# EAGLE design project2 (EAGLE 9.6.2)
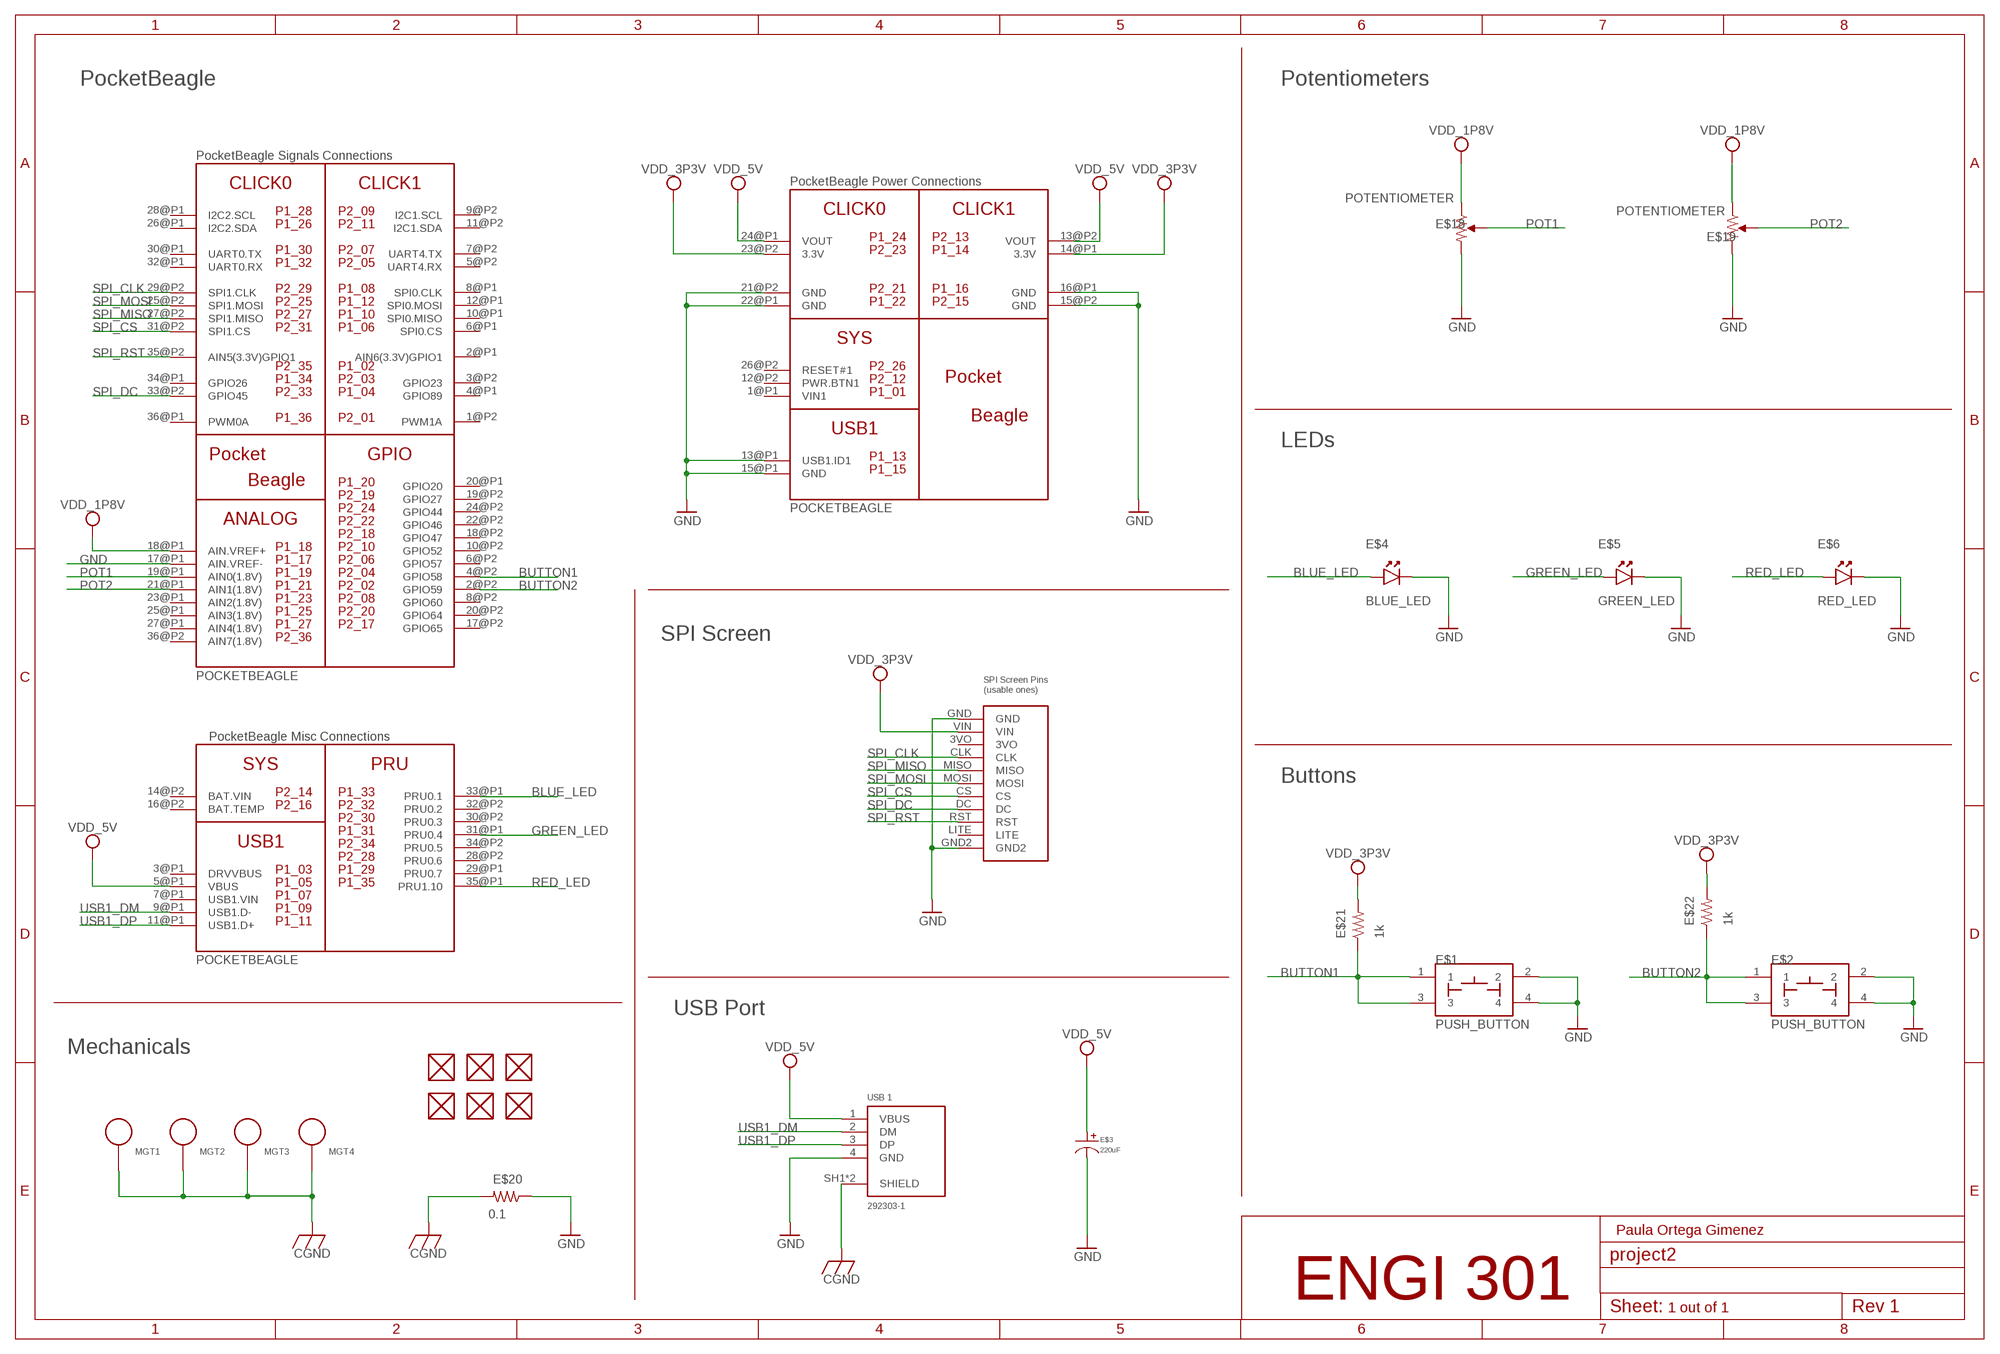
[diagram p0: schematic, sheet 1]

## Parts
E$1  PUSH_BUTTON  [BUTTON_12.5MM]
E$2  PUSH_BUTTON  [BUTTON_12.5MM]
E$3  220uF  CAPACITOR_P_10MM  [CP10MM]
E$4  BLUE_LED  LED  [EIA-STD]
E$5  GREEN_LED  LED  [EIA-STD]
E$6  RED_LED  LED  [EIA-STD]
E$18  POTENTIOMETER  [POT-PO90S]
E$19  POTENTIOMETER  [POT-PO90S]
E$20  0.1  R_R0805  [R0805]
E$21  1k  R_R0805  [R0805]
E$22  1k  R_R0805  [R0805]
E$24  292303-1  [TE_292303-1]
FUD1  FIDUCIAL  [FIDUCIAL_40MIL]
FUD2  FIDUCIAL  [FIDUCIAL_40MIL]
FUD3  FIDUCIAL  [FIDUCIAL_40MIL]
FUD4  FIDUCIAL  [FIDUCIAL_40MIL]
FUD5  FIDUCIAL  [FIDUCIAL_40MIL]
FUD6  FIDUCIAL  [FIDUCIAL_40MIL]
MGT1  MOUNTING_HOLE  [MOUNTING_HOLE]
MGT2  MOUNTING_HOLE  [MOUNTING_HOLE]
MGT3  MOUNTING_HOLE  [MOUNTING_HOLE]
MGT4  MOUNTING_HOLE  [MOUNTING_HOLE]
U1  SPI  [SPI]
U$1  POCKETBEAGLE  [POCKETBEAGLE]

## Nets
BLUE_LED: E$4.ANODE U$1.33@P1(PRU0.1)
BUTTON1: E$1.1 E$1.3 E$21.1 U$1.4@P2(GPIO58)
BUTTON2: E$2.1 E$2.3 E$22.1 U$1.2@P2(GPIO59)
CGND: E$20.2 E$24.SH1(SHIELD) E$24.SH2(SHIELD) MGT1.P$1 MGT2.P$1 MGT3.P$1 MGT4.P$1
GND: E$1.2 E$1.4 E$2.2 E$2.4 E$3.P$2 E$4.CATHODE E$5.CATHODE E$6.CATHODE E$18.CW E$19.CW E$20.1 E$24.4(GND) U1.GND U1.GND2 U$1.13@P1(USB1.ID1) U$1.15@P1(GND) U$1.15@P2(GND) U$1.16@P1(GND) U$1.17@P1(AIN.VREF-) U$1.21@P2(GND) U$1.22@P1(GND)
GREEN_LED: E$5.ANODE U$1.31@P1(PRU0.4)
POT1: E$18.S U$1.19@P1(AIN0(1.8V))
POT2: E$19.S U$1.21@P1(AIN1(1.8V))
RED_LED: E$6.ANODE U$1.35@P1(PRU1.10)
SPI_CLK: U1.CLK U$1.29@P2(SPI1.CLK)
SPI_CS: U1.CS U$1.31@P2(SPI1.CS)
SPI_DC: U1.DC U$1.33@P2(GPIO45)
SPI_MISO: U1.MISO U$1.27@P2(SPI1.MISO)
SPI_MOSI: U1.MOSI U$1.25@P2(SPI1.MOSI)
SPI_RST: U1.RST U$1.35@P2(AIN5(3.3V)GPIO1)
USB1_DM: E$24.2(DM) U$1.9@P1(USB1.D-)
USB1_DP: E$24.3(DP) U$1.11@P1(USB1.D+)
VDD_1P8V: E$18.CCW E$19.CCW U$1.18@P1(AIN.VREF+)
VDD_3P3V: E$21.2 E$22.2 U1.VIN U$1.14@P1(3.3V) U$1.23@P2(3.3V)
VDD_5V: E$3.P$1 E$24.1(VBUS) U$1.5@P1(VBUS) U$1.13@P2(VOUT) U$1.24@P1(VOUT)
Unconnected: FUD1.P$1 FUD2.P$1 FUD3.P$1 FUD4.P$1 FUD5.P$1 FUD6.P$1 U1.3VO U1.LITE U$1.1@P2(PWM1A) U$1.2@P1(AIN6(3.3V)GPIO1) U$1.3@P1(DRVVBUS) U$1.3@P2(GPIO23) U$1.4@P1(GPIO89) U$1.5@P2(UART4.RX) U$1.6@P1(SPI0.CS) U$1.6@P2(GPIO57) U$1.7@P1(USB1.VIN) U$1.7@P2(UART4.TX) U$1.8@P1(SPI0.CLK) U$1.8@P2(GPIO60) U$1.9@P2(I2C1.SCL) U$1.10@P1(SPI0.MISO) U$1.10@P2(GPIO52) U$1.11@P2(I2C1.SDA) U$1.12@P1(SPI0.MOSI) U$1.12@P2(PWR.BTN1) U$1.16@P2(BAT.TEMP) U$1.17@P2(GPIO65) U$1.18@P2(GPIO47) U$1.19@P2(GPIO27) U$1.20@P1(GPIO20) U$1.20@P2(GPIO64) U$1.22@P2(GPIO46) U$1.23@P1(AIN2(1.8V)) U$1.24@P2(GPIO44) U$1.25@P1(AIN3(1.8V)) U$1.26@P1(I2C2.SDA) U$1.26@P2(RESET#1) U$1.27@P1(AIN4(1.8V)) U$1.28@P1(I2C2.SCL) U$1.28@P2(PRU0.6) U$1.29@P1(PRU0.7) U$1.30@P1(UART0.TX) U$1.30@P2(PRU0.3) U$1.32@P1(UART0.RX) U$1.32@P2(PRU0.2) U$1.34@P1(GPIO26) U$1.34@P2(PRU0.5) U$1.36@P1(PWM0A) U$1.36@P2(AIN7(1.8V))

## Notes on the sheet
- PocketBeagle | Potentiometers
- LEDs
- SPI Screen
- Buttons
- USB Port
- Mechanicals
- Paula Ortega Gimenez
- ENGI 301
- 1 out of 1

## Power pins joined to a net without a drawn wire
BAT.VIN: U$1.14@P2(BAT.VIN)
VIN1: U$1.1@P1(VIN1)

## Library data of the parts
E$1 E$2 = project2:PUSH_BUTTON
E$3 = project2:CAPACITOR_P: Library: MF_Passives Description: Device for Polarized Capacitors. Manufacture part number (MPN), Voltage Rating, and Tolerance can be added via Attributes. Check https://factory.macrofab.com/parts for the house parts list.; POPULATE: 1
E$4-E$6 = project2:LED: LTST-C191TBKT
E$18 E$19 = project2:POTENTIOMETER: Potentiometer - Examples: P090S-14T20BR10K (987-1277-ND)
E$20-E$22 = project2:R_: RESISTOR, American symbol
E$24 = project2:292303-1: CONN USB RECEPT R/A TYPE A 4POS; CENTERLINE_PITCH: 2 mm[.078 in]; CHECK_PRICES: https://www.snapeda.com/parts/292303-1/TE+Connectivity+AMP+Connectors/view-part/?ref=eda; COMMENT: 292303-1; DESCRIPTION: Type A Standard USB Connector 4 Position Right Angle Mount 1 Port | TE Connectivity 292303-1; DIGIKEY_PART_NUMBER: A31726-ND; EU_ROHS_COMPLIANCE: Compliant; MF: TE Connectivity; MP: 292303-1; NUMBER_OF_POSITIONS: 4; PACKAGE: None; PRODUCT_TYPE: Connector; PURCHASE-URL: https://www.snapeda.com/api/url_track_click_mouser/?unipart_id=447501&manufacturer=TE Connectivity&part_name=292303-1&search_term=292303-1; SNAPEDA_LINK: https://www.snapeda.com/parts/292303-1/TE+Connectivity+AMP+Connectors/view-part/?ref=snap
FUD1-FUD6 = project2:FIDUCIAL
MGT1-MGT4 = project2:MOUNTING_HOLE: Chassis Mounting Hole w/GND connection ability
U1 = project2:SPI
U$1 = project2:POCKETBEAGLE

## Board
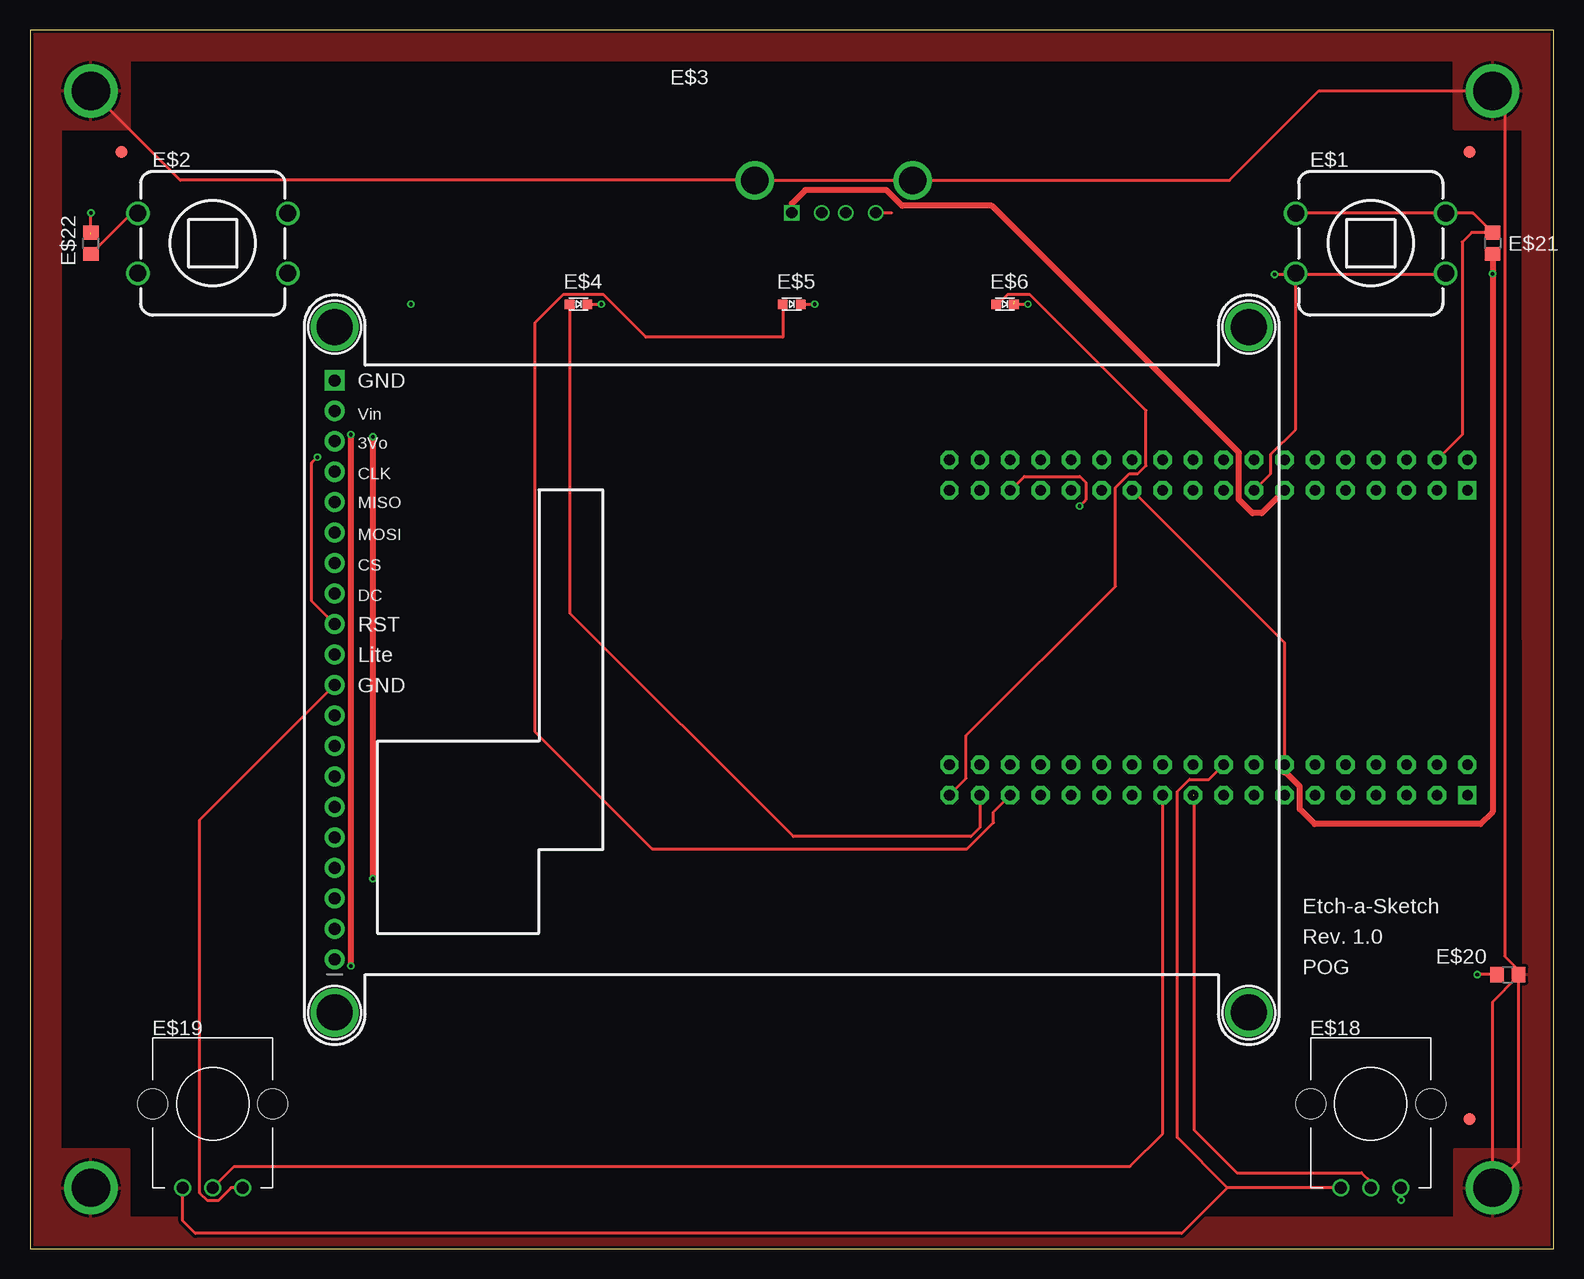
[diagram p1: board, top side]
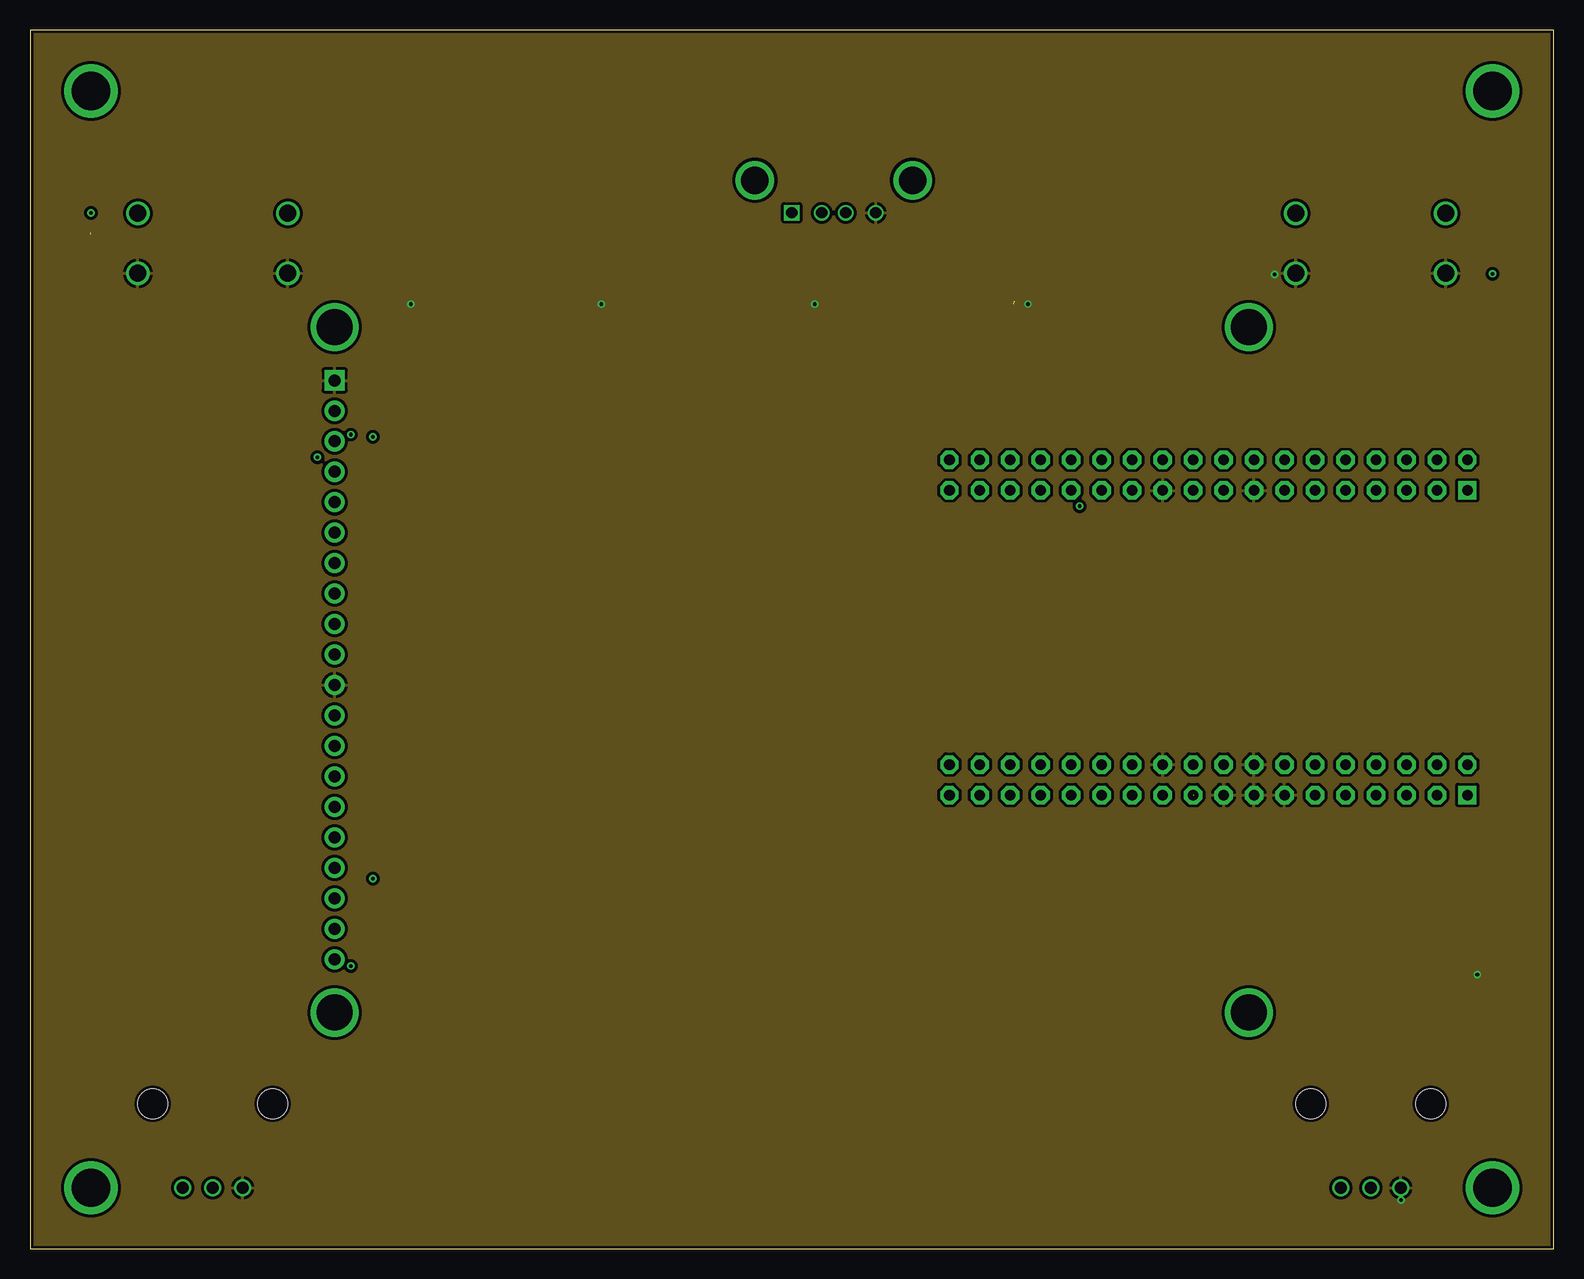
[diagram p2: board, inner layer Route2]
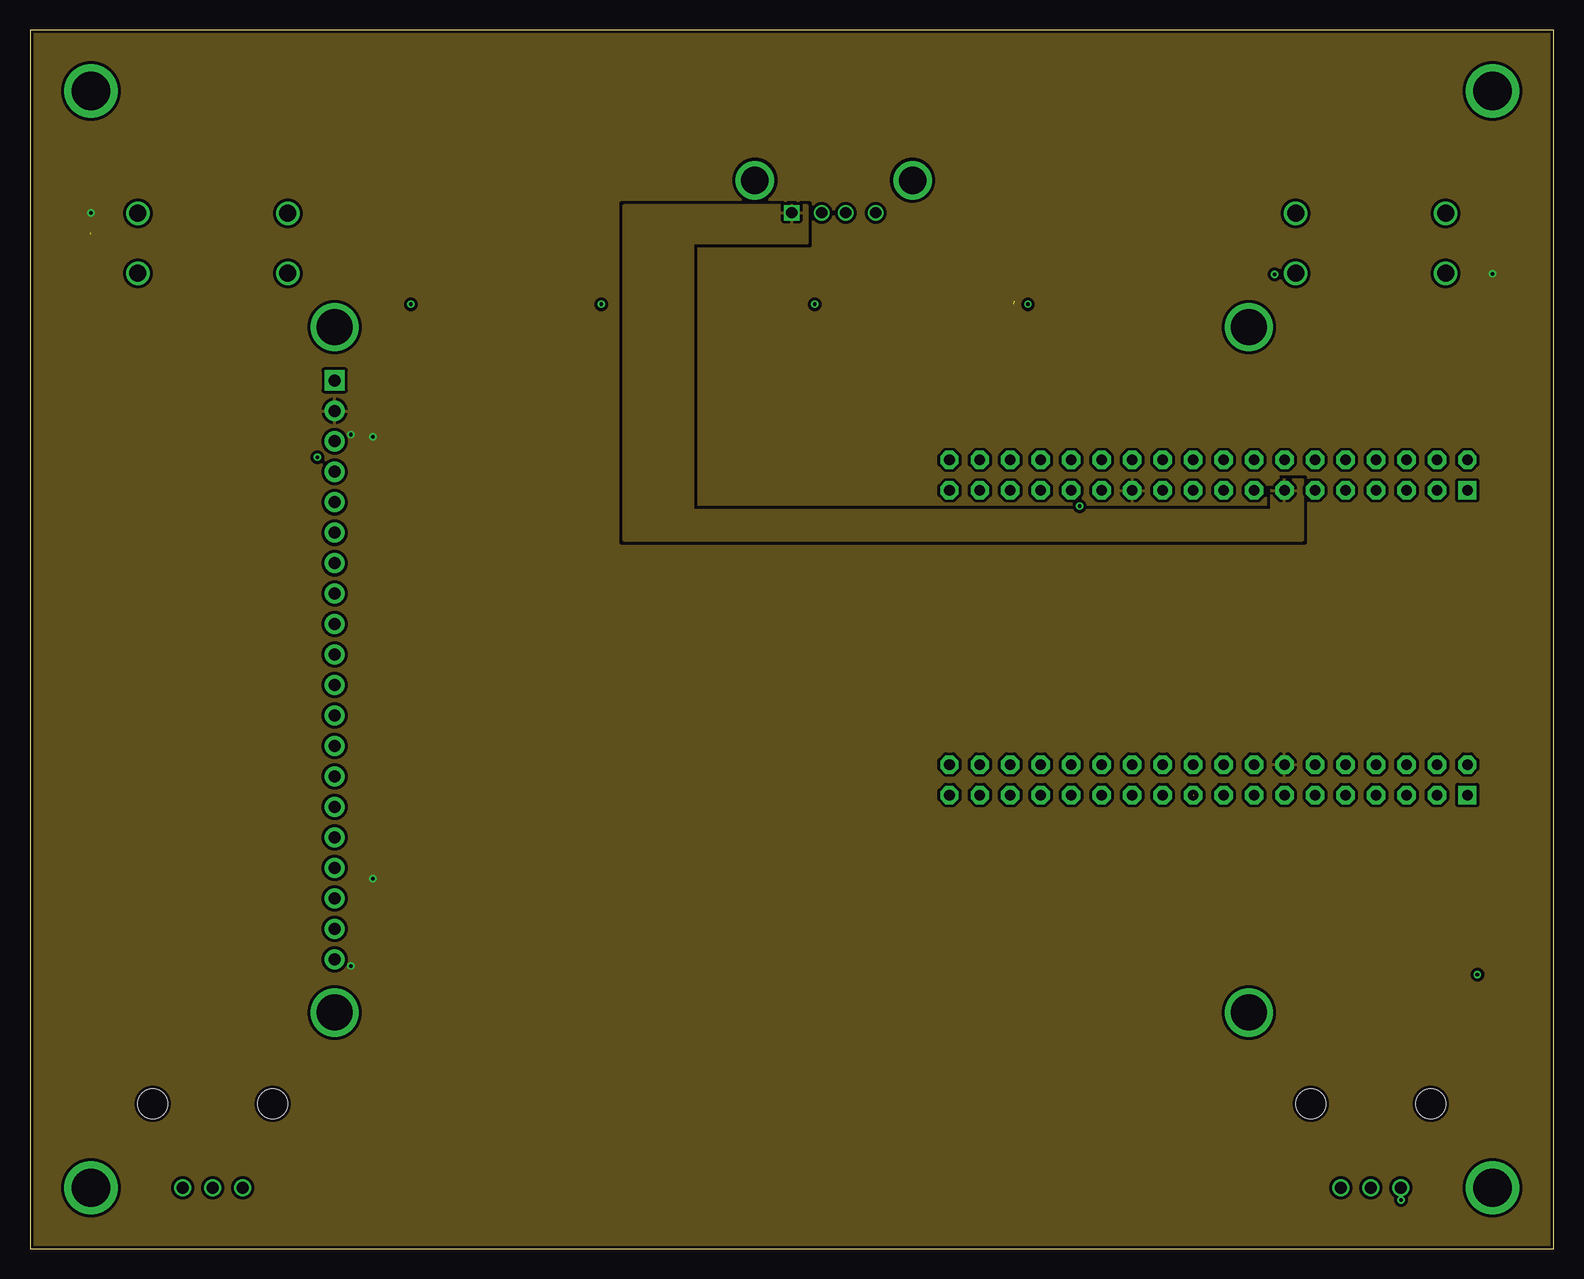
[diagram p3: board, inner layer Route15]
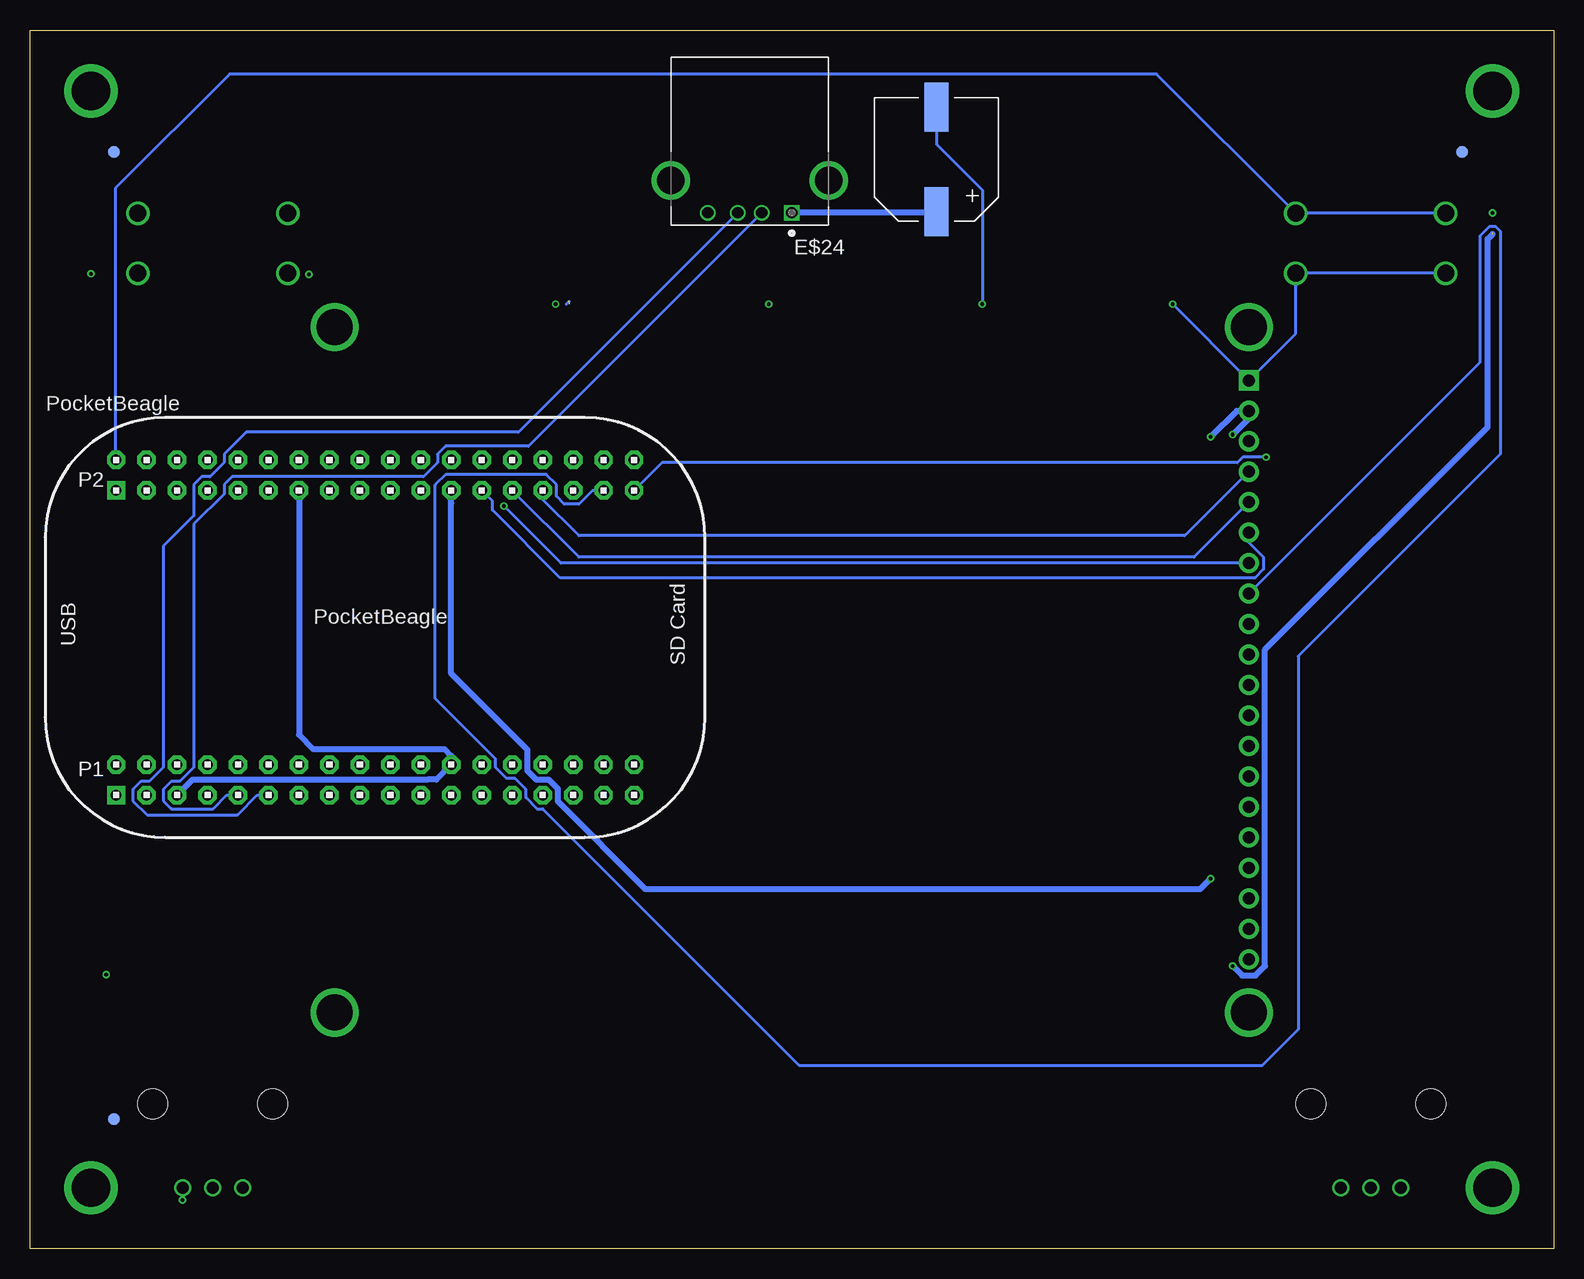
[diagram p4: board, bottom side, seen from below]

Size 127 x 101.6 mm. Coordinates in mm from the lower left corner, seen from the top.
Outline: 0,0 127,0 127,101.6 0,101.6 0,0
Copper layers (1*2*15*16): Top 0.035mm / dielectric 0.23mm / Route2 0.035mm / dielectric 0.93mm / Route15 0.035mm / dielectric 0.23mm / Bottom 0.035mm
Design rules "ENGI301_4lyr": minimum track width 10mil, minimum drill 12mil, track to track 10mil, track to pad 10mil, pad to pad 10mil, via to via 10mil, smd to smd 10mil, copper to edge 10mil, drill to drill 12mil, minimum pad ring 6mil, minimum via ring 6mil, stop-mask expansion 3mil, vias tented up to drill 25mil, thermal gap 10mil

### Footprints (pad centres in the part's own frame; a part is rotated, then mirrored left to right if it is on the bottom)
BUTTON_12.5MM = drill 1.4: 1 -6.25,2.5; 2 -6.25,-2.5; 3 6.25,2.5; 4 6.25,-2.5
CP10MM = smd 2 x 4.1: P$1 0,-4.35; P$2 0,4.35
EIA-STD = smd 0.8 x 0.8: ANODE -0.74,0; CATHODE 0.74,0
POT-PO90S = drill 1: CCW -2.5,0; CW 2.5,0; S 0,0 | hole 2.5: -5,7; 5,7
R0805 = smd 1.143 x 1.27: 1 -0.889,0; 2 0.889,0
TE_292303-1 = drill 0.92 square: 1 0,0 | drill 0.92: 2 2.5,0; 3 4.5,0; 4 7,0 | drill 2.3: SH1 -3.07,-2.71; SH2 10.07,-2.71
FIDUCIAL_40MIL = smd 1.016 x 1.016: P$1 0,0
MOUNTING_HOLE = drill 3.175 pad 4.445: P$1 0,0
SPI = drill 1 pad 1.676: 3VO -19.05,-38.1; 12@JP2 3.81,-38.1; 13@JP2 6.35,-38.1; 14@JP2 8.89,-38.1; 15@JP2 11.43,-38.1; 16@JP2 13.97,-38.1; 17@JP2 16.51,-38.1; 18@JP2 19.05,-38.1; 19@JP2 21.59,-38.1; 20@JP2 24.13,-38.1; CLK -16.51,-38.1; CS -8.89,-38.1; DC -6.35,-38.1; GND2 1.27,-38.1; LITE -1.27,-38.1; MISO -13.97,-38.1; MOSI -11.43,-38.1; RST -3.81,-38.1; VIN -21.59,-38.1 | drill 1 pad 1.676 square: GND -24.13,-38.1 | drill 3 pad 3.6: P$1@U$7 -28.575,-38.1; P$1@U$15 28.575,-38.1; P$1@U$16 -28.575,38.1; P$1@U$17 28.575,38.1
POCKETBEAGLE = drill 0.889 pad 1.524 square: 1@P1 5.91,3.53; 1@P2 5.91,28.93 | drill 0.889 pad 1.524 octagon: 2@P1 5.91,6.07; 2@P2 5.91,31.47; 3@P1 8.45,3.53; 3@P2 8.45,28.93; 4@P1 8.45,6.07; 4@P2 8.45,31.47; 5@P1 10.99,3.53; 5@P2 10.99,28.93; 6@P1 10.99,6.07; 6@P2 10.99,31.47; 7@P1 13.53,3.53; 7@P2 13.53,28.93; 8@P1 13.53,6.07; 8@P2 13.53,31.47; 9@P1 16.07,3.53; 9@P2 16.07,28.93; 10@P1 16.07,6.07; 10@P2 16.07,31.47; 11@P1 18.61,3.53; 11@P2 18.61,28.93; 12@P1 18.61,6.07; 12@P2 18.61,31.47; 13@P1 21.15,3.53; 13@P2 21.15,28.93; 14@P1 21.15,6.07; 14@P2 21.15,31.47; 15@P1 23.69,3.53; 15@P2 23.69,28.93; 16@P1 23.69,6.07; 16@P2 23.69,31.47; 17@P1 26.23,3.53; 17@P2 26.23,28.93; 18@P1 26.23,6.07; 18@P2 26.23,31.47; 19@P1 28.77,3.53; 19@P2 28.77,28.93; 20@P1 28.77,6.07; 20@P2 28.77,31.47; 21@P1 31.31,3.53; 21@P2 31.31,28.93; 22@P1 31.31,6.07; 22@P2 31.31,31.47; 23@P1 33.85,3.53; 23@P2 33.85,28.93; 24@P1 33.85,6.07; 24@P2 33.85,31.47; 25@P1 36.39,3.53; 25@P2 36.39,28.93; 26@P1 36.39,6.07; 26@P2 36.39,31.47; 27@P1 38.93,3.53; 27@P2 38.93,28.93; 28@P1 38.93,6.07; 28@P2 38.93,31.47; 29@P1 41.47,3.53; 29@P2 41.47,28.93; 30@P1 41.47,6.07; 30@P2 41.47,31.47; 31@P1 44.01,3.53; 31@P2 44.01,28.93; 32@P1 44.01,6.07; 32@P2 44.01,31.47; 33@P1 46.55,3.53; 33@P2 46.55,28.93; 34@P1 46.55,6.07; 34@P2 46.55,31.47; 35@P1 49.09,3.53; 35@P2 49.09,28.93; 36@P1 49.09,6.07; 36@P2 49.09,31.47

### Placement (x,y rotation side)
E$1  111.76,83.82 0 top
E$2  15.24,83.82 0 top
E$3  51.44,90.81 0 bottom
E$4  45.72,78.74 0 top
E$5  63.5,78.74 0 top
E$6  81.28,78.74 0 top
E$18  111.76,5.08 0 top
E$19  15.24,5.08 0 top
E$20  123.19,22.86 0 top
E$21  121.92,83.82 270 top
E$22  5.08,83.82 90 top
E$24  63.5,86.36 180 bottom
FUD1  7.62,91.44 0 bottom
FUD2  120.02,91.44 0 bottom
FUD3  120.02,10.79 0 bottom
FUD4  7.62,91.44 0 top
FUD5  120.02,91.44 0 top
FUD6  120.02,10.79 0 top
MGT1  5.08,96.52 0 top
MGT2  121.92,96.52 0 top
MGT3  5.08,5.08 0 top
MGT4  121.92,5.08 0 top
U1  63.5,48.26 270 top
U$1  125.73,34.29 0 bottom

### Tracks (layer width: path | path; a pad name or v marks a point on that pad's centre or on a via)
BLUE_LED
  Top 0.254: U$1.33@P1 79.18,35.11 78.42,34.35 63.63,34.35 44.98,52.99 E$4.ANODE
BUTTON1
  Top 0.254: U$1.4@P2 119.38,67.86 119.38,83.91 120.17,84.71 E$21.1 120.31,86.32 E$1.3 E$1.1
BUTTON2
  Top 0.254: E$22.1 8.47,86.32 E$2.1
  Bottom 0.254: U$1.2@P2 119.89,65.83 119.89,88.39 110.36,97.92 33.09,97.92 E$2.3 E$2.1
CGND
  Top 0.254: MGT1.P$1 12.53,89.07 E$24.SH1 E$24.SH2 99.99,89.07 107.44,96.52 MGT2.P$1 122.94,95.5 122.94,24.38 123.95,23.37 123.95,22.61 121.92,20.57 MGT4.P$1 124.08,7.24 E$20.2
  pour Top: -1.27,50.8 -1.27,-1.27 128.27,-1.27 128.27,50.8 124.46,50.8 124.46,8.26 118.75,8.26 118.75,2.54 8.26,2.54 8.26,8.26 2.54,8.26 2.54,50.8
  pour Top: -1.27,50.8 -1.27,102.87 128.27,102.87 128.27,50.8 124.46,50.8 124.46,93.34 118.75,93.34 118.75,99.06 8.26,99.06 8.26,93.34 2.54,93.34 2.54,50.8
GND  (via drill 0.3 pad 0.61)  (1 unrouted)
  Top 0.254: E$4.CATHODE v47.62,78.74 | v65.41,78.74 E$5.CATHODE 64.66,78.74 | v83.19,78.74 E$6.CATHODE 81.88,78.74 | E$20.1 120.78,22.86 v120.65,22.86 | U$1.15@P2 103.44,64.62 103.44,66.23 105.51,68.31 E$1.2 105.41,81.22 | U1.GND2 14.16,35.75 14.16,4.63 14.79,4 15.69,4 16.77,5.08 E$19.CW | E$24.4 71.82,86.36 | 105.41,81.22 v103.76,81.22 | E$1.4 117.91,81.22 105.41,81.22 | E$18.CW 114.3,5.04 v114.3,4.06
  Bottom 0.254: E$3.P$2 51.44,92.08 47.62,88.27 v47.62,78.74 | E$2.2 E$2.4 21.49,76.3 U1.GND v31.75,78.74 | 82.3,78.74 82.04,78.99
  pour Route2: -2.54,-2.54 -2.54,104.14 129.54,104.14 129.54,-2.54
GREEN_LED
  Top 0.254: E$5.ANODE 62.76,75.99 51.35,75.99 47.81,79.52 44.42,79.52 42.06,77.16 42.06,43.13 51.86,33.34 78.12,33.34 80.32,35.54 80.32,36.42 U$1.31@P1
POT1  (1 unrouted)
  Top 0.254: 97.03,37.8 97.03,9.91 100.58,6.35 111,6.35 111.76,5.59 E$18.S | U$1.19@P1 97,37.82
POT2
  Top 0.254: E$19.S 17.02,6.86 91.69,6.86 94.42,9.58 U$1.21@P1
RED_LED
  Top 0.254: U$1.35@P1 78.04,39.22 78.04,42.77 90.48,55.22 90.48,63.44 91.66,64.62 92.35,64.62 93.02,65.29 93.02,69.87 83.37,79.52 81.46,79.52 80.68,78.74 E$6.ANODE
SPI_CLK
  Bottom 0.254: U1.CLK 30.73,59.44 81.24,59.44 84.26,62.46 U$1.29@P2
SPI_CS  (via drill 0.3 pad 0.61)
  Top 0.254: U$1.31@P2 82.89,64.39 87.5,64.39 88.01,63.89 88.01,62.42 v87.5,61.91
  Bottom 0.254: U1.CS 82.74,57.15 v87.5,61.91
SPI_DC
  Bottom 0.254: U$1.33@P2 80.1,63.22 81.25,62.08 82.46,62.08 83.12,62.73 83.12,63.7 83.97,64.56 92.35,64.56 93.22,63.69 93.22,45.85 88.2,40.83 88.2,40.14 87.27,39.22 86.58,39.22 85.66,38.29 85.66,37.6 84.73,36.68 84.25,36.68 62.88,15.3 24.26,15.3 21.27,18.29 21.27,49.41 4.45,66.23 4.45,84.84 4.82,85.22 5.34,85.22 6.13,84.43 6.13,73.88 U1.DC
SPI_MISO
  Bottom 0.254: U1.MISO 29.97,57.66 81.24,57.66 U$1.27@P2
SPI_MOSI
  Bottom 0.254: U$1.25@P2 88.45,62.33 88.45,61.57 82.81,55.93 24.89,55.93 24.18,56.65 24.18,57.66 25.4,58.87 U1.MOSI
SPI_RST  (via drill 0.3 pad 0.61)
  Top 0.254: U1.RST 23.5,53.98 23.5,65.53 v23.95,65.99
  Bottom 0.254: v23.95,65.99 25.91,65.99 26.36,65.53 74.33,65.53 U$1.35@P2
USB1_DM
  Bottom 0.254: E$24.2 85.46,66.9 92.35,66.9 93.02,66.23 93.02,65.54 94.2,64.36 110.13,64.36 110.8,63.69 110.8,62.93 113.34,60.39 113.34,40.14 114.52,38.96 115.21,38.96 115.88,38.29 115.88,37.35 115.21,36.68 111.73,36.68 110.58,37.82 U$1.9@P1
USB1_DP
  Bottom 0.254: E$24.3 86.29,68.07 108.96,68.07 110.8,66.23 110.8,65.54 111.98,64.36 112.67,64.36 113.34,63.69 113.34,61.11 115.88,58.57 115.88,40.14 117.06,38.96 117.75,38.96 118.42,38.29 118.42,37.35 117.25,36.17 109.69,36.17 108.04,37.82 U$1.11@P1
VDD_1P8V
  Top 0.254: E$18.CCW 99.82,5.08 | U$1.18@P1 98.28,39.14 96.66,39.14 95.63,38.11 95.63,9.27 99.82,5.08 | E$19.CCW 12.74,2.31 13.78,1.27 96.01,1.27 99.82,5.08
VDD_3P3V  (via drill 0.3 pad 0.61)  (1 unrouted)
  Top 0.254: E$22.2 v5.08,86.36 | U$1.23@P2 104.58,50.52 U$1.14@P1
  Top 0.508: E$21.2 v121.92,81.28 121.92,36.42 120.9,35.41 107.09,35.41 105.85,36.64 105.85,38.55 104.58,39.82 | 104.58,39.69 104.58,39.82 | 104.58,39.82 U$1.14@P1 | v26.75,67.87 v26.75,23.57 | v28.57,67.69 v28.57,30.86
  Bottom 0.508: 91.88,62.16 U$1.23@P2 91.88,47.94 85.53,41.59 85.53,39.83 84.79,39.09 83.73,39.09 82.99,38.35 82.99,37.29 75.67,29.97 29.46,29.97 v28.57,30.86 | v26.75,67.87 25.45,69.16 25.4,69.16 U1.VIN 26.42,69.85 v28.57,67.69 | v26.75,23.57 25.96,22.78 24.84,22.78 24.05,23.57 24.05,49.94 5.5,68.49 5.5,84.16 5.08,84.58
  pour Route15 (rank 6): -5.08,-5.08 -5.08,106.68 132.08,106.68 132.08,-5.08
VDD_5V
  Top 0.508: U$1.13@P2 102.67,61.31 101.91,61.31 100.77,62.45 100.77,66.29 100.81,66.32 80.18,86.95 72.69,86.95 71.38,88.27 64.64,88.27 63.5,87.12 E$24.1
  Bottom 0.508: U$1.5@P1 113.47,39.09 93.89,39.09 93.87,39.12 93.12,39.12 U$1.24@P1 91.88,41.08 92.46,41.66 103.38,41.66 104.58,42.86 U$1.13@P2 | E$3.P$1 51.53,86.36 E$24.1
  pour Route15: 103.5,61.59 103.5,64.14 106.05,64.14 106.05,59.05 49.53,59.05 49.53,87 64.77,87 64.77,83.82 55.24,83.82 55.24,61.59

### Text on the board
tPlace: Etch-a-Sketch | Rev. 1.0 | POG